# Altium schematic sheet ContadorAsincronico_SCH.SchDoc
size A4
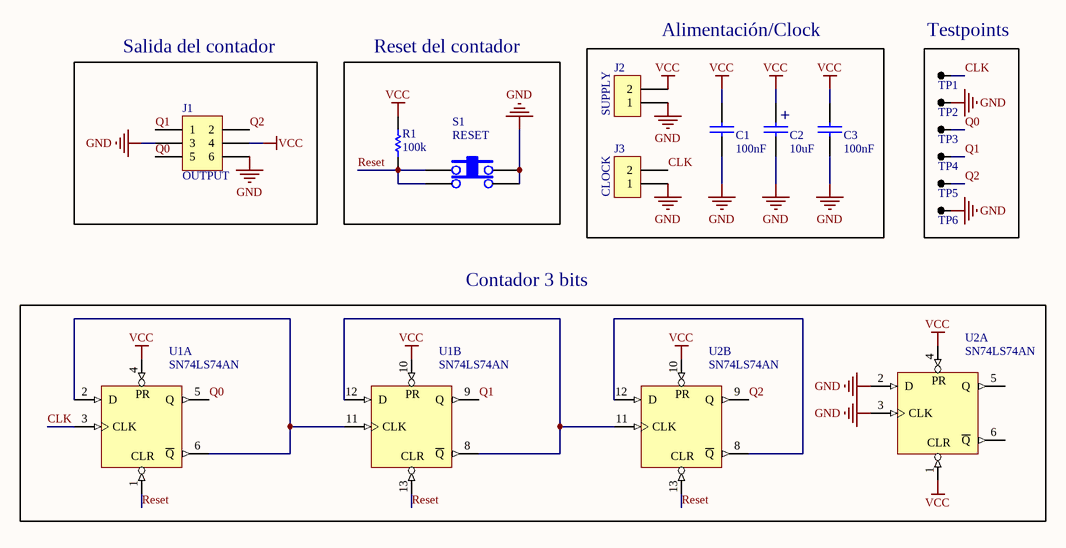
[diagram p0: ContadorAsincronico_SCH.SchDoc]

## Parts
C1  100nF  [0805]
C2  10uF  [CAP100RP]
C3  100nF  [0805]
J1  OUTPUT  [SIP3*2]
J2  SUPPLY  [BORNERA2]
J3  CLOCK  [BORNERA2]
R1  100k  [0805]
S1  RESET  [TACTSWITCH]
TP1  CLK  [TPTH]  (value not drawn)
TP2  GND  [TPTH]  (value not drawn)
TP3  Q0  [TPTH]  (value not drawn)
TP4  Q1  [TPTH]  (value not drawn)
TP5  Q2  [TPTH]  (value not drawn)
TP6  GND  [TPTH]  (value not drawn)
U1  SN74LS74AN  [N014D]  (parts A,B of 2)
U2  SN74LS74AN  [N014D]  (parts A,B of 2)

## Blocks framed on the sheet
Salida del contador: J1
Reset del contador: R1 S1
Alimentación/Clock: C1-C3 J2 J3
Testpoints: TP1-TP6
Contador 3 bits: U1 U2

## Nets
GND: C1.2 C2.2 C3.2 J1.3 J1.6 J2.1 J3.1 S1.3 S1.4 TP2.1 TP6.1 U1.7(GND) U2.2(D) U2.3(CLK) U2.7(GND)
VCC: C1.1 C2.1 C3.1 J1.4 J2.2 R1.1 U1.4(PR) U1.10(PR) U1.14(VCC) U2.1(CLR) U2.4(PR) U2.10(PR) U2.14(VCC)
CLK: J3.2 TP1.1 U1.3(CLK)
Q0: J1.5 TP3.1 U1.5(Q)
Q1: J1.1 TP4.1 U1.9(Q)
Q2: J1.2 TP5.1 U2.9(Q)
Reset: R1.2 S1.1 S1.2 U1.1(CLR) U1.13(CLR) U2.13(CLR)
NetU1_2: U1.2(D) U1.6(~{Q}) U1.11(CLK)
NetU1_8: U1.8(~{Q}) U1.12(D) U2.11(CLK)
NetU2_8: U2.8(~{Q}) U2.12(D)

Not connected (* = marked no-connect by the designer): U2 5(Q) 6(~{Q})

## Notes on the sheet
- (in symbol CAPPOL) +

## Library data of the parts
C1 C3 = CAP: Value: 100nF; Footprint: SMD 0805
C2 = CAPPOL: Value: 10uF; Footprint: THT
J1 = CON3*2: Value: Pines Macho; Footprint: Pines Macho
J2 J3 = BORNERA 2: Value: BORNERA2
R1 = RES: Value: 100k; Footprint: SMD 0805
S1 = TACT SWITCH: Value: Pulsador; Footprint: THT
TP1-TP6 = TP: Value: Pin Macho; Footprint: Pin Macho
U1 U2 = SN74LS74AN: Dual D-Type Positive-Edge-Triggered Flip-Flop with Preset and Clear; Value: 74LS74; Footprint: THT DIP14